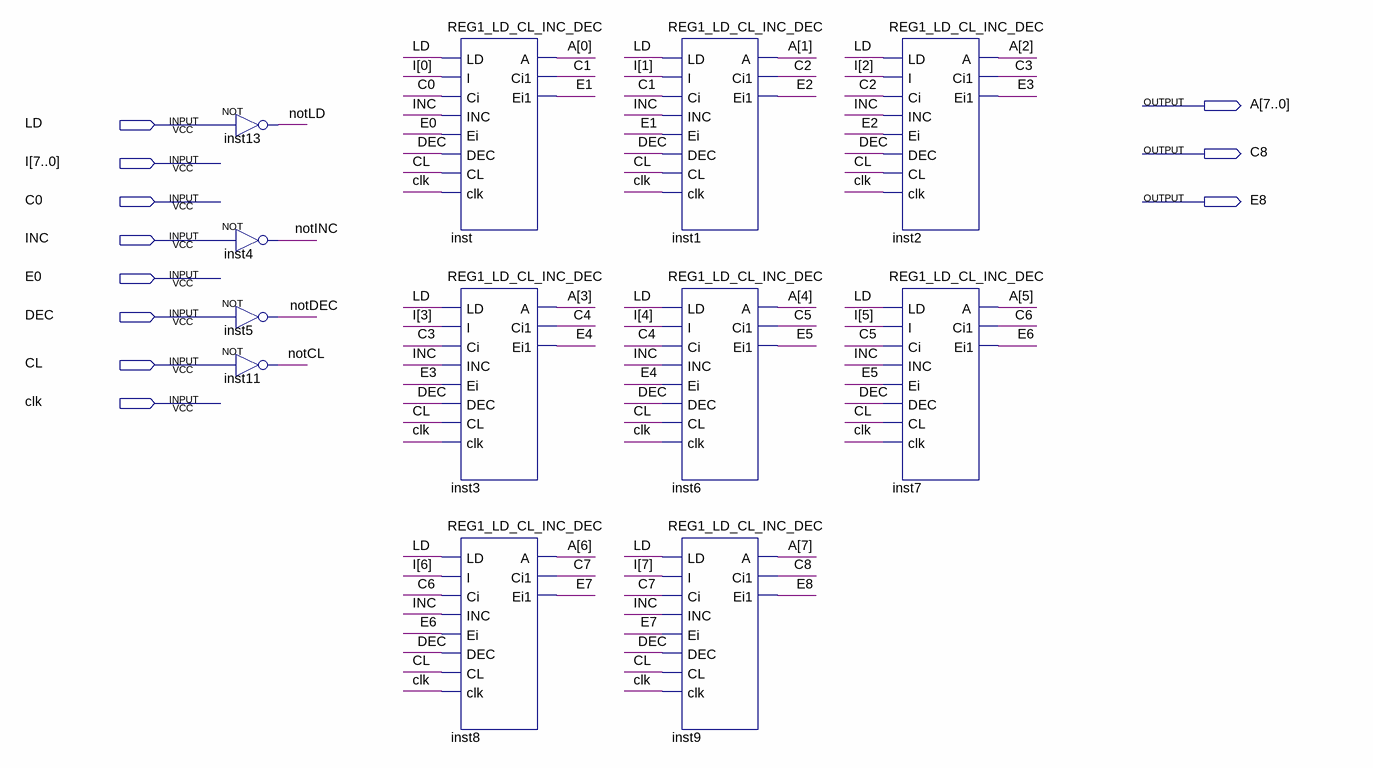
[diagram p0: schematic sheet]
// Quartus schematic REG8_LD_CL_INC_DEC.bdf as structural Verilog: 12 symbols, 11 pins
module REG8_LD_CL_INC_DEC (
  input  LD,
  input  [7:0] I,
  input  C0,
  input  INC,
  input  E0,
  input  DEC,
  input  CL,
  input  clk,
  output [7:0] A,
  output C8,
  output E8
);

  wire C1, C2, C3, C4, C5, C6, C7, E1, E2, E3, E4, E5, E6, E7, notCL, notDEC, notINC, notLD;

  not inst13 (notLD, LD);
  not inst4 (notINC, INC);
  not inst5 (notDEC, DEC);
  not inst11 (notCL, CL);
  REG1_LD_CL_INC_DEC inst (
    .LD(LD), .I(I[0]), .Ci(C0), .INC(INC), .Ei(E0), .DEC(DEC), .CL(CL), .clk(clk), .A(A[0]), .Ci1(C1),
    .Ei1(E1));
  REG1_LD_CL_INC_DEC inst3 (
    .LD(LD), .I(I[3]), .Ci(C3), .INC(INC), .Ei(E3), .DEC(DEC), .CL(CL), .clk(clk), .A(A[3]), .Ci1(C4),
    .Ei1(E4));
  REG1_LD_CL_INC_DEC inst8 (
    .LD(LD), .I(I[6]), .Ci(C6), .INC(INC), .Ei(E6), .DEC(DEC), .CL(CL), .clk(clk), .A(A[6]), .Ci1(C7),
    .Ei1(E7));
  REG1_LD_CL_INC_DEC inst1 (
    .LD(LD), .I(I[1]), .Ci(C1), .INC(INC), .Ei(E1), .DEC(DEC), .CL(CL), .clk(clk), .A(A[1]), .Ci1(C2),
    .Ei1(E2));
  REG1_LD_CL_INC_DEC inst6 (
    .LD(LD), .I(I[4]), .Ci(C4), .INC(INC), .Ei(E4), .DEC(DEC), .CL(CL), .clk(clk), .A(A[4]), .Ci1(C5),
    .Ei1(E5));
  REG1_LD_CL_INC_DEC inst9 (
    .LD(LD), .I(I[7]), .Ci(C7), .INC(INC), .Ei(E7), .DEC(DEC), .CL(CL), .clk(clk), .A(A[7]), .Ci1(C8),
    .Ei1(E8));
  REG1_LD_CL_INC_DEC inst2 (
    .LD(LD), .I(I[2]), .Ci(C2), .INC(INC), .Ei(E2), .DEC(DEC), .CL(CL), .clk(clk), .A(A[2]), .Ci1(C3),
    .Ei1(E3));
  REG1_LD_CL_INC_DEC inst7 (
    .LD(LD), .I(I[5]), .Ci(C5), .INC(INC), .Ei(E5), .DEC(DEC), .CL(CL), .clk(clk), .A(A[5]), .Ci1(C6),
    .Ei1(E6));
endmodule
